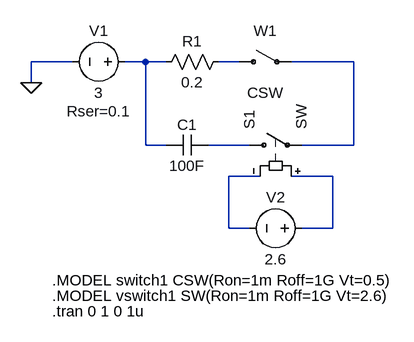
[diagram p0: schematic q2_secondtry.asc]
q2_secondtry.asc, the LTspice schematic file:
Version 4
SHEET 1 880 680
WIRE 32 112 -32 112
WIRE 144 112 112 112
WIRE 176 112 144 112
WIRE 288 112 256 112
WIRE 464 112 368 112
WIRE -32 144 -32 112
WIRE 144 240 144 112
WIRE 176 240 144 240
WIRE 304 240 240 240
WIRE 464 240 464 112
WIRE 464 240 384 240
WIRE 320 288 272 288
WIRE 432 288 368 288
WIRE 272 368 272 288
WIRE 304 368 272 368
WIRE 432 368 432 288
WIRE 432 368 384 368
FLAG -32 144 0
SYMBOL voltage 128 112 R90
WINDOW 0 -32 56 VBottom 2
WINDOW 3 32 56 VTop 2
WINDOW 123 0 0 Left 0
WINDOW 39 60 56 VTop 2
SYMATTR InstName V1
SYMATTR Value 3
SYMATTR SpiceLine Rser=0.1
SYMBOL res 272 96 R90
WINDOW 0 0 56 VBottom 2
WINDOW 3 32 56 VTop 2
SYMATTR InstName R1
SYMATTR Value 0.2
SYMBOL csw 288 112 R270
WINDOW 0 32 40 VTop 2
WINDOW 3 -32 40 VBottom 2
SYMATTR InstName W1
SYMATTR SpiceModel switch1
SYMBOL cap 240 224 R90
WINDOW 0 0 32 VBottom 2
WINDOW 3 32 32 VTop 2
SYMATTR InstName C1
SYMATTR Value 100F
SYMATTR SpiceLine V=2.7
SYMBOL sw 288 240 R270
SYMATTR InstName S1
SYMATTR SpiceModel vswitch1
SYMBOL voltage 400 368 R90
WINDOW 0 -32 56 VBottom 2
WINDOW 3 32 56 VTop 2
WINDOW 123 0 0 Left 0
WINDOW 39 0 0 Left 0
SYMATTR InstName V2
SYMATTR Value 2.6
TEXT 0 448 Left 2 !.MODEL switch1 CSW(Ron=1m Roff=1G Vt=0.5)
TEXT 0 472 Left 2 !.MODEL vswitch1 SW(Ron=1m Roff=1G Vt=2.6)
TEXT 0 496 Left 2 !.tran 0 1 0 1u

The netlist it stands for:
* q2_secondtry.asc
V1 N001 0 3 Rser=0.1
R1 N002 N001 0.2
W1 N002 N003 switch1 CSW
C1 N004 N001 100F V=2.7
S1 N004 N003 N006 N005 vswitch1 SW
V2 N006 N005 2.6
.MODEL switch1 CSW(Ron=1m Roff=1G Vt=0.5)
.MODEL vswitch1 SW(Ron=1m Roff=1G Vt=2.6)
.tran 0 1 0 1u
.backanno
.end